# Altium schematic sheet serial.SCHDOC
size B
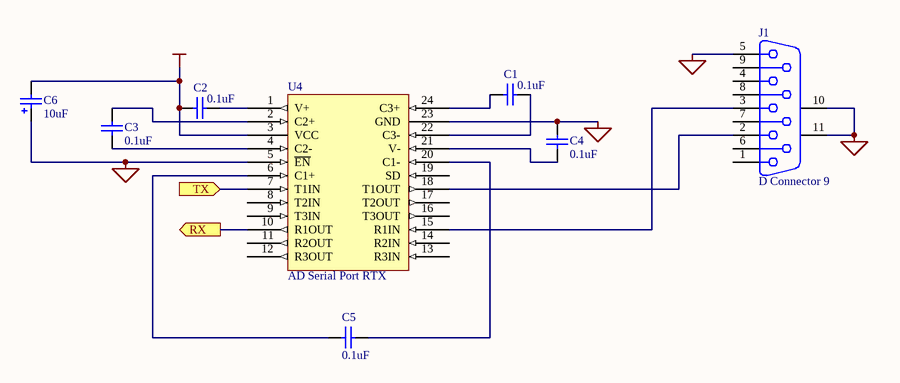
[diagram p0: serial.SCHDOC]

## Parts
C1  value 0.1uF  [CC1608-0603]  (hidden comment: Cap)
C2  value 0.1uF  [CC1608-0603]  (hidden comment: Cap)
C3  value 0.1uF  [CC1608-0603]  (hidden comment: Cap)
C4  value 0.1uF  [CC1608-0603]  (hidden comment: Cap)
C5  value 0.1uF  [CC1608-0603]  (hidden comment: Cap)
C6  value 10uF  [TC7360-2924]  (hidden comment: Cap Pol1)
J1  D Connector 9  [DSUB1.385-2H9]
U4  AD Serial Port RTX  [SSO-G24]

## Ports
RX (out), TX (in)

## Nets
GND: C4.2 C6.1 J1.5 J1.10(MH1) J1.11(MH2) U4.5(~{EN}) U4.23(GND)
VCC: C2.2 C6.2 U4.3(VCC)
RX: U4.10(R1OUT) ; port RX
TX: U4.7(T1IN) ; port TX
NetC1_1: C1.1 U4.22(C3-)
NetC1_2: C1.2 U4.24(C3+)
NetC2_1: C2.1 U4.1(V+)
NetC3_1: C3.1 U4.4(C2-)
NetC3_2: C3.2 U4.2(C2+)
NetC4_1: C4.1 U4.21(V-)
NetC5_1: C5.1 U4.20(C1-)
NetC5_2: C5.2 U4.6(C1+)
NetJ1_2: J1.2 U4.18(T1OUT)
NetJ1_3: J1.3 U4.15(R1IN)

Not connected (* = marked no-connect by the designer): J1 1 4 6 7 8 9; U4 8(T2IN) 9(T3IN) 11(R2OUT) 12(R3OUT) 13(R3IN) 14(R2IN) 16(T3OUT) 17(T2OUT) 19(SD)

## Library data of the parts
C1-C5 = Cap: Capacitor; Manufacturer: Generic Components; Class I: Passive; Published: 8-Jun-2000; Revision: July-2002: Re-released for DXP Platform.; Publisher: Altium Limited; Class II: Capacitor
C6 = Cap Pol1: Polarized Capacitor (Radial); Manufacturer: Generic Components; Class I: Passive; Published: 8-Jun-2000; Revision: July-2002: Re-released for DXP Platform.; Publisher: Altium Limited; Class II: Capacitor
J1 = D Connector 9: Receptacle Assembly, 9 Position, Right Angle; Manufacturer: Generic Components; Package Information: Latest Revision: O; Positions: 9; Published: 15-Jun-2001; Revision: July-2002: Re-released for DXP Platform.; Datasheet: (1-Sep-1999); Package Reference: 788750; Publisher: Altium Limited; Class I: Connector; Orientation: Right Angle; Gender: Receptacle
U4 = ADM3312E: AD Serial port transceivers